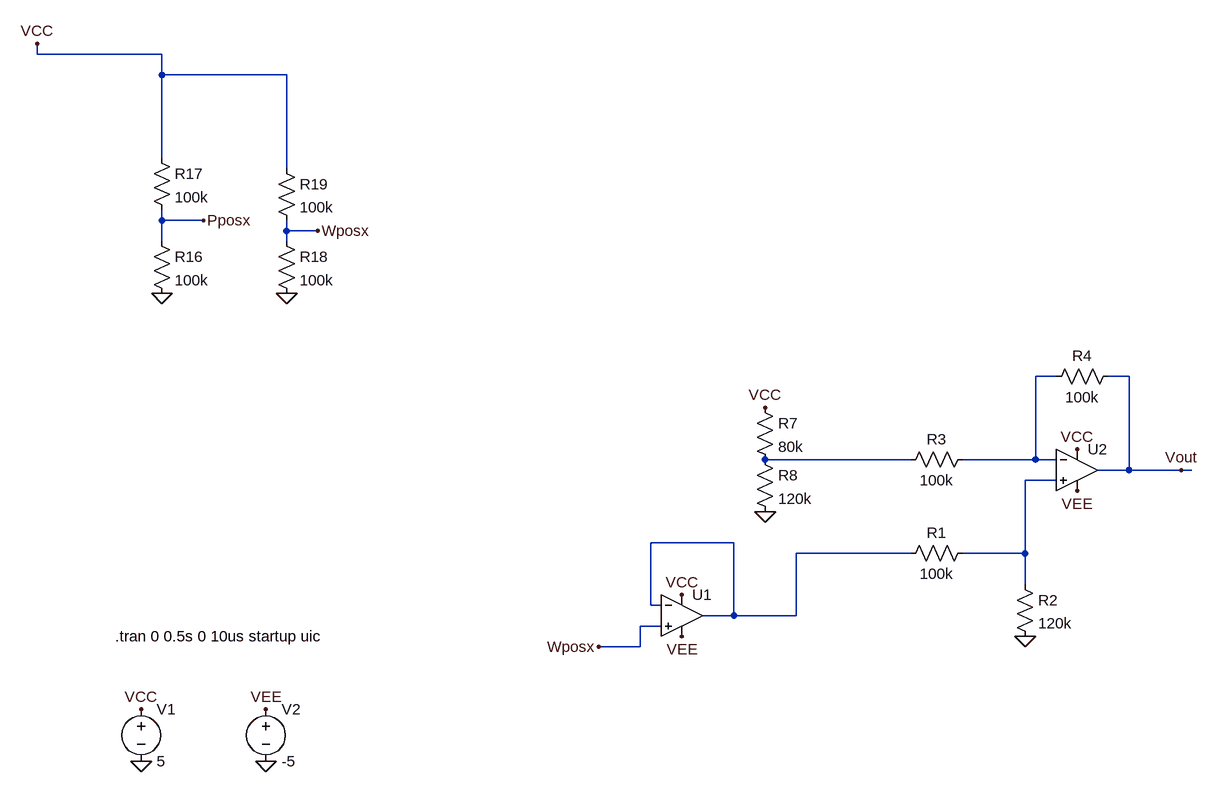
[diagram p0: schematic analog-vg-circuit-stabber-protov1.asc]
analog-vg-circuit-stabber-protov1.asc, the LTspice schematic file:
Version 4
SHEET 1 5224 1764
WIRE 2144 -336 2144 -352
WIRE 2336 -336 2144 -336
WIRE 2336 -304 2336 -336
WIRE 2528 -304 2336 -304
WIRE 2336 -176 2336 -304
WIRE 2528 -160 2528 -304
WIRE 2336 -80 2336 -96
WIRE 2400 -80 2336 -80
WIRE 2528 -64 2528 -80
WIRE 2576 -64 2528 -64
WIRE 2336 -48 2336 -80
WIRE 2528 -48 2528 -64
WIRE 3712 160 3680 160
WIRE 3824 160 3792 160
WIRE 3488 288 3264 288
WIRE 3680 288 3680 160
WIRE 3680 288 3568 288
WIRE 3712 288 3680 288
WIRE 3824 304 3824 160
WIRE 3824 304 3776 304
WIRE 3904 304 3824 304
WIRE 3920 304 3904 304
WIRE 3712 320 3664 320
WIRE 3216 416 3088 416
WIRE 3488 432 3312 432
WIRE 3664 432 3664 320
WIRE 3664 432 3568 432
WIRE 3664 480 3664 432
WIRE 3088 512 3088 416
WIRE 3104 512 3088 512
WIRE 3216 528 3216 416
WIRE 3216 528 3168 528
WIRE 3312 528 3312 432
WIRE 3312 528 3216 528
WIRE 3104 544 3072 544
WIRE 3072 576 3072 544
WIRE 3072 576 3008 576
FLAG 3744 272 VCC
FLAG 3744 336 VEE
FLAG 2496 752 0
FLAG 2304 672 VCC
FLAG 3008 576 Wposx
FLAG 2336 32 0
FLAG 2400 -80 Pposx
FLAG 2528 32 0
FLAG 2576 -64 Wposx
FLAG 2144 -352 VCC
FLAG 2304 752 0
FLAG 2496 672 VEE
FLAG 3664 560 0
FLAG 3904 304 Vout
FLAG 3136 496 VCC
FLAG 3136 560 VEE
FLAG 3264 208 VCC
FLAG 3264 368 0
SYMBOL res 3584 272 R90
WINDOW 0 0 56 VBottom 2
WINDOW 3 32 56 VTop 2
SYMATTR InstName R3
SYMATTR Value 100k
SYMBOL Opamps\\UniversalOpamp2 3744 304 R0
SYMATTR InstName U2
SYMBOL res 3808 144 R90
WINDOW 0 0 56 VBottom 2
WINDOW 3 32 56 VTop 2
SYMATTR InstName R4
SYMATTR Value 100k
SYMBOL voltage 2496 656 R0
WINDOW 123 0 0 Left 2
WINDOW 39 0 0 Left 2
SYMATTR InstName V2
SYMATTR Value -5
SYMBOL res 2320 -64 R0
SYMATTR InstName R16
SYMATTR Value 100k
SYMBOL res 2320 -192 R0
SYMATTR InstName R17
SYMATTR Value 100k
SYMBOL res 2512 -64 R0
SYMATTR InstName R18
SYMATTR Value 100k
SYMBOL res 2512 -176 R0
SYMATTR InstName R19
SYMATTR Value 100k
SYMBOL voltage 2304 656 R0
WINDOW 123 0 0 Left 2
WINDOW 39 0 0 Left 2
SYMATTR InstName V1
SYMATTR Value 5
SYMBOL res 3584 416 R90
WINDOW 0 0 56 VBottom 2
WINDOW 3 32 56 VTop 2
SYMATTR InstName R1
SYMATTR Value 100k
SYMBOL res 3648 464 R0
SYMATTR InstName R2
SYMATTR Value 120k
SYMBOL Opamps\\UniversalOpamp2 3136 528 R0
SYMATTR InstName U1
SYMBOL res 3248 192 R0
SYMATTR InstName R7
SYMATTR Value 80k
SYMBOL res 3248 272 R0
SYMATTR InstName R8
SYMATTR Value 120k
TEXT 2264 560 Left 2 !.tran 0 0.5s 0 10us startup uic

The netlist it stands for:
* analog-vg-circuit-stabber-protov1.asc
R3 N001 N002 100k
XU2 N003 N001 VCC VEE Vout level.2 Avol=1Meg GBW=10Meg Slew=10Meg ilimit=25m rail=0 Vos=0 phimargin=45 en=0 enk=0 in=0 ink=0 Rin=500Meg  ; pins IN+ IN- V+ V- OUT
R4 Vout N001 100k
V2 VEE 0 -5
R16 Pposx 0 100k
R17 VCC Pposx 100k
R18 Wposx 0 100k
R19 VCC Wposx 100k
V1 VCC 0 5
R1 N003 N004 100k
R2 N003 0 120k
XU1 Wposx N004 VCC VEE N004 level.2 Avol=1Meg GBW=10Meg Slew=10Meg ilimit=25m rail=0 Vos=0 phimargin=45 en=0 enk=0 in=0 ink=0 Rin=500Meg  ; pins IN+ IN- V+ V- OUT
R7 VCC N002 80k
R8 N002 0 120k
.tran 0 0.5s 0 10us startup uic
.lib UniversalOpamps2.sub
.backanno
.end